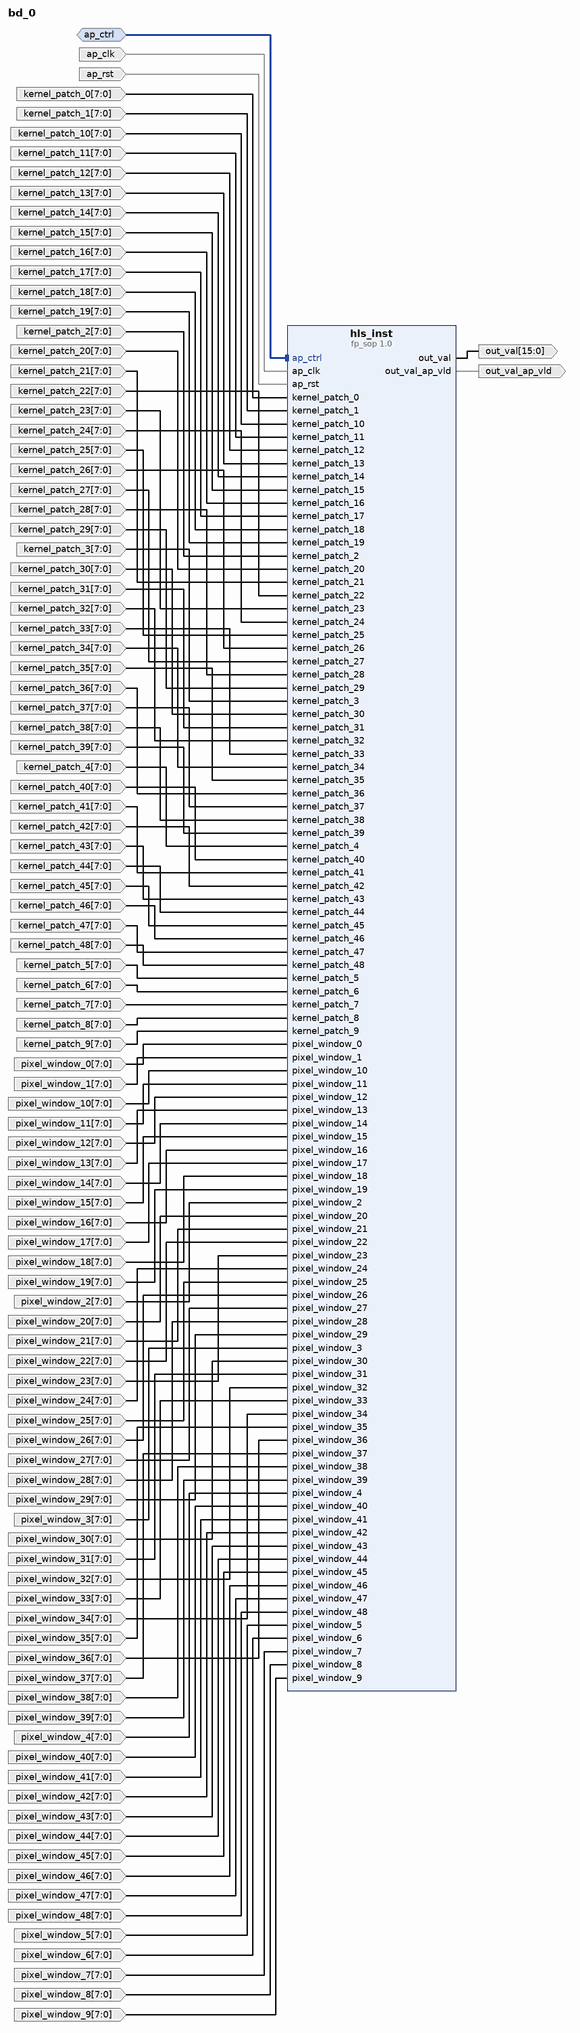
[diagram p0: block diagram of the top level]
# Vivado block design bd_0, xc7a100tcsg324-1, Vivado 2019.2
create_bd_design bd_0

create_bd_intf_port -mode Slave -vlnv xilinx.com:interface:acc_handshake_rtl:1.0 ap_ctrl
create_bd_port -dir I -type clk ap_clk
set_property -dict {CONFIG.FREQ_HZ 100000000.0} [get_bd_ports ap_clk]
create_bd_port -dir I -type rst ap_rst
set_property -dict {CONFIG.POLARITY ACTIVE_HIGH} [get_bd_ports ap_rst]
create_bd_port -dir I -from 7 -to 0 -type data kernel_patch_0
create_bd_port -dir I -from 7 -to 0 -type data kernel_patch_1
create_bd_port -dir I -from 7 -to 0 -type data kernel_patch_10
create_bd_port -dir I -from 7 -to 0 -type data kernel_patch_11
create_bd_port -dir I -from 7 -to 0 -type data kernel_patch_12
create_bd_port -dir I -from 7 -to 0 -type data kernel_patch_13
create_bd_port -dir I -from 7 -to 0 -type data kernel_patch_14
create_bd_port -dir I -from 7 -to 0 -type data kernel_patch_15
create_bd_port -dir I -from 7 -to 0 -type data kernel_patch_16
create_bd_port -dir I -from 7 -to 0 -type data kernel_patch_17
create_bd_port -dir I -from 7 -to 0 -type data kernel_patch_18
create_bd_port -dir I -from 7 -to 0 -type data kernel_patch_19
create_bd_port -dir I -from 7 -to 0 -type data kernel_patch_2
create_bd_port -dir I -from 7 -to 0 -type data kernel_patch_20
create_bd_port -dir I -from 7 -to 0 -type data kernel_patch_21
create_bd_port -dir I -from 7 -to 0 -type data kernel_patch_22
create_bd_port -dir I -from 7 -to 0 -type data kernel_patch_23
create_bd_port -dir I -from 7 -to 0 -type data kernel_patch_24
create_bd_port -dir I -from 7 -to 0 -type data kernel_patch_25
create_bd_port -dir I -from 7 -to 0 -type data kernel_patch_26
create_bd_port -dir I -from 7 -to 0 -type data kernel_patch_27
create_bd_port -dir I -from 7 -to 0 -type data kernel_patch_28
create_bd_port -dir I -from 7 -to 0 -type data kernel_patch_29
create_bd_port -dir I -from 7 -to 0 -type data kernel_patch_3
create_bd_port -dir I -from 7 -to 0 -type data kernel_patch_30
create_bd_port -dir I -from 7 -to 0 -type data kernel_patch_31
create_bd_port -dir I -from 7 -to 0 -type data kernel_patch_32
create_bd_port -dir I -from 7 -to 0 -type data kernel_patch_33
create_bd_port -dir I -from 7 -to 0 -type data kernel_patch_34
create_bd_port -dir I -from 7 -to 0 -type data kernel_patch_35
create_bd_port -dir I -from 7 -to 0 -type data kernel_patch_36
create_bd_port -dir I -from 7 -to 0 -type data kernel_patch_37
create_bd_port -dir I -from 7 -to 0 -type data kernel_patch_38
create_bd_port -dir I -from 7 -to 0 -type data kernel_patch_39
create_bd_port -dir I -from 7 -to 0 -type data kernel_patch_4
create_bd_port -dir I -from 7 -to 0 -type data kernel_patch_40
create_bd_port -dir I -from 7 -to 0 -type data kernel_patch_41
create_bd_port -dir I -from 7 -to 0 -type data kernel_patch_42
create_bd_port -dir I -from 7 -to 0 -type data kernel_patch_43
create_bd_port -dir I -from 7 -to 0 -type data kernel_patch_44
create_bd_port -dir I -from 7 -to 0 -type data kernel_patch_45
create_bd_port -dir I -from 7 -to 0 -type data kernel_patch_46
create_bd_port -dir I -from 7 -to 0 -type data kernel_patch_47
create_bd_port -dir I -from 7 -to 0 -type data kernel_patch_48
create_bd_port -dir I -from 7 -to 0 -type data kernel_patch_5
create_bd_port -dir I -from 7 -to 0 -type data kernel_patch_6
create_bd_port -dir I -from 7 -to 0 -type data kernel_patch_7
create_bd_port -dir I -from 7 -to 0 -type data kernel_patch_8
create_bd_port -dir I -from 7 -to 0 -type data kernel_patch_9
create_bd_port -dir O -from 15 -to 0 -type data out_val
create_bd_port -dir O out_val_ap_vld
create_bd_port -dir I -from 7 -to 0 -type data pixel_window_0
create_bd_port -dir I -from 7 -to 0 -type data pixel_window_1
create_bd_port -dir I -from 7 -to 0 -type data pixel_window_10
create_bd_port -dir I -from 7 -to 0 -type data pixel_window_11
create_bd_port -dir I -from 7 -to 0 -type data pixel_window_12
create_bd_port -dir I -from 7 -to 0 -type data pixel_window_13
create_bd_port -dir I -from 7 -to 0 -type data pixel_window_14
create_bd_port -dir I -from 7 -to 0 -type data pixel_window_15
create_bd_port -dir I -from 7 -to 0 -type data pixel_window_16
create_bd_port -dir I -from 7 -to 0 -type data pixel_window_17
create_bd_port -dir I -from 7 -to 0 -type data pixel_window_18
create_bd_port -dir I -from 7 -to 0 -type data pixel_window_19
create_bd_port -dir I -from 7 -to 0 -type data pixel_window_2
create_bd_port -dir I -from 7 -to 0 -type data pixel_window_20
create_bd_port -dir I -from 7 -to 0 -type data pixel_window_21
create_bd_port -dir I -from 7 -to 0 -type data pixel_window_22
create_bd_port -dir I -from 7 -to 0 -type data pixel_window_23
create_bd_port -dir I -from 7 -to 0 -type data pixel_window_24
create_bd_port -dir I -from 7 -to 0 -type data pixel_window_25
create_bd_port -dir I -from 7 -to 0 -type data pixel_window_26
create_bd_port -dir I -from 7 -to 0 -type data pixel_window_27
create_bd_port -dir I -from 7 -to 0 -type data pixel_window_28
create_bd_port -dir I -from 7 -to 0 -type data pixel_window_29
create_bd_port -dir I -from 7 -to 0 -type data pixel_window_3
create_bd_port -dir I -from 7 -to 0 -type data pixel_window_30
create_bd_port -dir I -from 7 -to 0 -type data pixel_window_31
create_bd_port -dir I -from 7 -to 0 -type data pixel_window_32
create_bd_port -dir I -from 7 -to 0 -type data pixel_window_33
create_bd_port -dir I -from 7 -to 0 -type data pixel_window_34
create_bd_port -dir I -from 7 -to 0 -type data pixel_window_35
create_bd_port -dir I -from 7 -to 0 -type data pixel_window_36
create_bd_port -dir I -from 7 -to 0 -type data pixel_window_37
create_bd_port -dir I -from 7 -to 0 -type data pixel_window_38
create_bd_port -dir I -from 7 -to 0 -type data pixel_window_39
create_bd_port -dir I -from 7 -to 0 -type data pixel_window_4
create_bd_port -dir I -from 7 -to 0 -type data pixel_window_40
create_bd_port -dir I -from 7 -to 0 -type data pixel_window_41
create_bd_port -dir I -from 7 -to 0 -type data pixel_window_42
create_bd_port -dir I -from 7 -to 0 -type data pixel_window_43
create_bd_port -dir I -from 7 -to 0 -type data pixel_window_44
create_bd_port -dir I -from 7 -to 0 -type data pixel_window_45
create_bd_port -dir I -from 7 -to 0 -type data pixel_window_46
create_bd_port -dir I -from 7 -to 0 -type data pixel_window_47
create_bd_port -dir I -from 7 -to 0 -type data pixel_window_48
create_bd_port -dir I -from 7 -to 0 -type data pixel_window_5
create_bd_port -dir I -from 7 -to 0 -type data pixel_window_6
create_bd_port -dir I -from 7 -to 0 -type data pixel_window_7
create_bd_port -dir I -from 7 -to 0 -type data pixel_window_8
create_bd_port -dir I -from 7 -to 0 -type data pixel_window_9

create_bd_cell -type ip -vlnv xilinx.com:hls:fp_sop:1.0 hls_inst

# ---- connections ----

connect_bd_intf_net -intf_net ap_ctrl_0_1 [get_bd_intf_ports ap_ctrl] [get_bd_intf_pins hls_inst/ap_ctrl]
connect_bd_net -net ap_clk_0_1 [get_bd_ports ap_clk] [get_bd_pins hls_inst/ap_clk]
connect_bd_net -net ap_rst_0_1 [get_bd_ports ap_rst] [get_bd_pins hls_inst/ap_rst]
connect_bd_net -net kernel_patch_0_0_1 [get_bd_ports kernel_patch_0] [get_bd_pins hls_inst/kernel_patch_0]
connect_bd_net -net kernel_patch_1_0_1 [get_bd_ports kernel_patch_1] [get_bd_pins hls_inst/kernel_patch_1]
connect_bd_net -net kernel_patch_10_0_1 [get_bd_ports kernel_patch_10] [get_bd_pins hls_inst/kernel_patch_10]
connect_bd_net -net kernel_patch_11_0_1 [get_bd_ports kernel_patch_11] [get_bd_pins hls_inst/kernel_patch_11]
connect_bd_net -net kernel_patch_12_0_1 [get_bd_ports kernel_patch_12] [get_bd_pins hls_inst/kernel_patch_12]
connect_bd_net -net kernel_patch_13_0_1 [get_bd_ports kernel_patch_13] [get_bd_pins hls_inst/kernel_patch_13]
connect_bd_net -net kernel_patch_14_0_1 [get_bd_ports kernel_patch_14] [get_bd_pins hls_inst/kernel_patch_14]
connect_bd_net -net kernel_patch_15_0_1 [get_bd_ports kernel_patch_15] [get_bd_pins hls_inst/kernel_patch_15]
connect_bd_net -net kernel_patch_16_0_1 [get_bd_ports kernel_patch_16] [get_bd_pins hls_inst/kernel_patch_16]
connect_bd_net -net kernel_patch_17_0_1 [get_bd_ports kernel_patch_17] [get_bd_pins hls_inst/kernel_patch_17]
connect_bd_net -net kernel_patch_18_0_1 [get_bd_ports kernel_patch_18] [get_bd_pins hls_inst/kernel_patch_18]
connect_bd_net -net kernel_patch_19_0_1 [get_bd_ports kernel_patch_19] [get_bd_pins hls_inst/kernel_patch_19]
connect_bd_net -net kernel_patch_2_0_1 [get_bd_ports kernel_patch_2] [get_bd_pins hls_inst/kernel_patch_2]
connect_bd_net -net kernel_patch_20_0_1 [get_bd_ports kernel_patch_20] [get_bd_pins hls_inst/kernel_patch_20]
connect_bd_net -net kernel_patch_21_0_1 [get_bd_ports kernel_patch_21] [get_bd_pins hls_inst/kernel_patch_21]
connect_bd_net -net kernel_patch_22_0_1 [get_bd_ports kernel_patch_22] [get_bd_pins hls_inst/kernel_patch_22]
connect_bd_net -net kernel_patch_23_0_1 [get_bd_ports kernel_patch_23] [get_bd_pins hls_inst/kernel_patch_23]
connect_bd_net -net kernel_patch_24_0_1 [get_bd_ports kernel_patch_24] [get_bd_pins hls_inst/kernel_patch_24]
connect_bd_net -net kernel_patch_25_0_1 [get_bd_ports kernel_patch_25] [get_bd_pins hls_inst/kernel_patch_25]
connect_bd_net -net kernel_patch_26_0_1 [get_bd_ports kernel_patch_26] [get_bd_pins hls_inst/kernel_patch_26]
connect_bd_net -net kernel_patch_27_0_1 [get_bd_ports kernel_patch_27] [get_bd_pins hls_inst/kernel_patch_27]
connect_bd_net -net kernel_patch_28_0_1 [get_bd_ports kernel_patch_28] [get_bd_pins hls_inst/kernel_patch_28]
connect_bd_net -net kernel_patch_29_0_1 [get_bd_ports kernel_patch_29] [get_bd_pins hls_inst/kernel_patch_29]
connect_bd_net -net kernel_patch_3_0_1 [get_bd_ports kernel_patch_3] [get_bd_pins hls_inst/kernel_patch_3]
connect_bd_net -net kernel_patch_30_0_1 [get_bd_ports kernel_patch_30] [get_bd_pins hls_inst/kernel_patch_30]
connect_bd_net -net kernel_patch_31_0_1 [get_bd_ports kernel_patch_31] [get_bd_pins hls_inst/kernel_patch_31]
connect_bd_net -net kernel_patch_32_0_1 [get_bd_ports kernel_patch_32] [get_bd_pins hls_inst/kernel_patch_32]
connect_bd_net -net kernel_patch_33_0_1 [get_bd_ports kernel_patch_33] [get_bd_pins hls_inst/kernel_patch_33]
connect_bd_net -net kernel_patch_34_0_1 [get_bd_ports kernel_patch_34] [get_bd_pins hls_inst/kernel_patch_34]
connect_bd_net -net kernel_patch_35_0_1 [get_bd_ports kernel_patch_35] [get_bd_pins hls_inst/kernel_patch_35]
connect_bd_net -net kernel_patch_36_0_1 [get_bd_ports kernel_patch_36] [get_bd_pins hls_inst/kernel_patch_36]
connect_bd_net -net kernel_patch_37_0_1 [get_bd_ports kernel_patch_37] [get_bd_pins hls_inst/kernel_patch_37]
connect_bd_net -net kernel_patch_38_0_1 [get_bd_ports kernel_patch_38] [get_bd_pins hls_inst/kernel_patch_38]
connect_bd_net -net kernel_patch_39_0_1 [get_bd_ports kernel_patch_39] [get_bd_pins hls_inst/kernel_patch_39]
connect_bd_net -net kernel_patch_4_0_1 [get_bd_ports kernel_patch_4] [get_bd_pins hls_inst/kernel_patch_4]
connect_bd_net -net kernel_patch_40_0_1 [get_bd_ports kernel_patch_40] [get_bd_pins hls_inst/kernel_patch_40]
connect_bd_net -net kernel_patch_41_0_1 [get_bd_ports kernel_patch_41] [get_bd_pins hls_inst/kernel_patch_41]
connect_bd_net -net kernel_patch_42_0_1 [get_bd_ports kernel_patch_42] [get_bd_pins hls_inst/kernel_patch_42]
connect_bd_net -net kernel_patch_43_0_1 [get_bd_ports kernel_patch_43] [get_bd_pins hls_inst/kernel_patch_43]
connect_bd_net -net kernel_patch_44_0_1 [get_bd_ports kernel_patch_44] [get_bd_pins hls_inst/kernel_patch_44]
connect_bd_net -net kernel_patch_45_0_1 [get_bd_ports kernel_patch_45] [get_bd_pins hls_inst/kernel_patch_45]
connect_bd_net -net kernel_patch_46_0_1 [get_bd_ports kernel_patch_46] [get_bd_pins hls_inst/kernel_patch_46]
connect_bd_net -net kernel_patch_47_0_1 [get_bd_ports kernel_patch_47] [get_bd_pins hls_inst/kernel_patch_47]
connect_bd_net -net kernel_patch_48_0_1 [get_bd_ports kernel_patch_48] [get_bd_pins hls_inst/kernel_patch_48]
connect_bd_net -net kernel_patch_5_0_1 [get_bd_ports kernel_patch_5] [get_bd_pins hls_inst/kernel_patch_5]
connect_bd_net -net kernel_patch_6_0_1 [get_bd_ports kernel_patch_6] [get_bd_pins hls_inst/kernel_patch_6]
connect_bd_net -net kernel_patch_7_0_1 [get_bd_ports kernel_patch_7] [get_bd_pins hls_inst/kernel_patch_7]
connect_bd_net -net kernel_patch_8_0_1 [get_bd_ports kernel_patch_8] [get_bd_pins hls_inst/kernel_patch_8]
connect_bd_net -net kernel_patch_9_0_1 [get_bd_ports kernel_patch_9] [get_bd_pins hls_inst/kernel_patch_9]
connect_bd_net [get_bd_pins hls_inst/out_val] [get_bd_ports out_val]
connect_bd_net [get_bd_pins hls_inst/out_val_ap_vld] [get_bd_ports out_val_ap_vld]
connect_bd_net -net pixel_window_0_0_1 [get_bd_ports pixel_window_0] [get_bd_pins hls_inst/pixel_window_0]
connect_bd_net -net pixel_window_1_0_1 [get_bd_ports pixel_window_1] [get_bd_pins hls_inst/pixel_window_1]
connect_bd_net -net pixel_window_10_0_1 [get_bd_ports pixel_window_10] [get_bd_pins hls_inst/pixel_window_10]
connect_bd_net -net pixel_window_11_0_1 [get_bd_ports pixel_window_11] [get_bd_pins hls_inst/pixel_window_11]
connect_bd_net -net pixel_window_12_0_1 [get_bd_ports pixel_window_12] [get_bd_pins hls_inst/pixel_window_12]
connect_bd_net -net pixel_window_13_0_1 [get_bd_ports pixel_window_13] [get_bd_pins hls_inst/pixel_window_13]
connect_bd_net -net pixel_window_14_0_1 [get_bd_ports pixel_window_14] [get_bd_pins hls_inst/pixel_window_14]
connect_bd_net -net pixel_window_15_0_1 [get_bd_ports pixel_window_15] [get_bd_pins hls_inst/pixel_window_15]
connect_bd_net -net pixel_window_16_0_1 [get_bd_ports pixel_window_16] [get_bd_pins hls_inst/pixel_window_16]
connect_bd_net -net pixel_window_17_0_1 [get_bd_ports pixel_window_17] [get_bd_pins hls_inst/pixel_window_17]
connect_bd_net -net pixel_window_18_0_1 [get_bd_ports pixel_window_18] [get_bd_pins hls_inst/pixel_window_18]
connect_bd_net -net pixel_window_19_0_1 [get_bd_ports pixel_window_19] [get_bd_pins hls_inst/pixel_window_19]
connect_bd_net -net pixel_window_2_0_1 [get_bd_ports pixel_window_2] [get_bd_pins hls_inst/pixel_window_2]
connect_bd_net -net pixel_window_20_0_1 [get_bd_ports pixel_window_20] [get_bd_pins hls_inst/pixel_window_20]
connect_bd_net -net pixel_window_21_0_1 [get_bd_ports pixel_window_21] [get_bd_pins hls_inst/pixel_window_21]
connect_bd_net -net pixel_window_22_0_1 [get_bd_ports pixel_window_22] [get_bd_pins hls_inst/pixel_window_22]
connect_bd_net -net pixel_window_23_0_1 [get_bd_ports pixel_window_23] [get_bd_pins hls_inst/pixel_window_23]
connect_bd_net -net pixel_window_24_0_1 [get_bd_ports pixel_window_24] [get_bd_pins hls_inst/pixel_window_24]
connect_bd_net -net pixel_window_25_0_1 [get_bd_ports pixel_window_25] [get_bd_pins hls_inst/pixel_window_25]
connect_bd_net -net pixel_window_26_0_1 [get_bd_ports pixel_window_26] [get_bd_pins hls_inst/pixel_window_26]
connect_bd_net -net pixel_window_27_0_1 [get_bd_ports pixel_window_27] [get_bd_pins hls_inst/pixel_window_27]
connect_bd_net -net pixel_window_28_0_1 [get_bd_ports pixel_window_28] [get_bd_pins hls_inst/pixel_window_28]
connect_bd_net -net pixel_window_29_0_1 [get_bd_ports pixel_window_29] [get_bd_pins hls_inst/pixel_window_29]
connect_bd_net -net pixel_window_3_0_1 [get_bd_ports pixel_window_3] [get_bd_pins hls_inst/pixel_window_3]
connect_bd_net -net pixel_window_30_0_1 [get_bd_ports pixel_window_30] [get_bd_pins hls_inst/pixel_window_30]
connect_bd_net -net pixel_window_31_0_1 [get_bd_ports pixel_window_31] [get_bd_pins hls_inst/pixel_window_31]
connect_bd_net -net pixel_window_32_0_1 [get_bd_ports pixel_window_32] [get_bd_pins hls_inst/pixel_window_32]
connect_bd_net -net pixel_window_33_0_1 [get_bd_ports pixel_window_33] [get_bd_pins hls_inst/pixel_window_33]
connect_bd_net -net pixel_window_34_0_1 [get_bd_ports pixel_window_34] [get_bd_pins hls_inst/pixel_window_34]
connect_bd_net -net pixel_window_35_0_1 [get_bd_ports pixel_window_35] [get_bd_pins hls_inst/pixel_window_35]
connect_bd_net -net pixel_window_36_0_1 [get_bd_ports pixel_window_36] [get_bd_pins hls_inst/pixel_window_36]
connect_bd_net -net pixel_window_37_0_1 [get_bd_ports pixel_window_37] [get_bd_pins hls_inst/pixel_window_37]
connect_bd_net -net pixel_window_38_0_1 [get_bd_ports pixel_window_38] [get_bd_pins hls_inst/pixel_window_38]
connect_bd_net -net pixel_window_39_0_1 [get_bd_ports pixel_window_39] [get_bd_pins hls_inst/pixel_window_39]
connect_bd_net -net pixel_window_4_0_1 [get_bd_ports pixel_window_4] [get_bd_pins hls_inst/pixel_window_4]
connect_bd_net -net pixel_window_40_0_1 [get_bd_ports pixel_window_40] [get_bd_pins hls_inst/pixel_window_40]
connect_bd_net -net pixel_window_41_0_1 [get_bd_ports pixel_window_41] [get_bd_pins hls_inst/pixel_window_41]
connect_bd_net -net pixel_window_42_0_1 [get_bd_ports pixel_window_42] [get_bd_pins hls_inst/pixel_window_42]
connect_bd_net -net pixel_window_43_0_1 [get_bd_ports pixel_window_43] [get_bd_pins hls_inst/pixel_window_43]
connect_bd_net -net pixel_window_44_0_1 [get_bd_ports pixel_window_44] [get_bd_pins hls_inst/pixel_window_44]
connect_bd_net -net pixel_window_45_0_1 [get_bd_ports pixel_window_45] [get_bd_pins hls_inst/pixel_window_45]
connect_bd_net -net pixel_window_46_0_1 [get_bd_ports pixel_window_46] [get_bd_pins hls_inst/pixel_window_46]
connect_bd_net -net pixel_window_47_0_1 [get_bd_ports pixel_window_47] [get_bd_pins hls_inst/pixel_window_47]
connect_bd_net -net pixel_window_48_0_1 [get_bd_ports pixel_window_48] [get_bd_pins hls_inst/pixel_window_48]
connect_bd_net -net pixel_window_5_0_1 [get_bd_ports pixel_window_5] [get_bd_pins hls_inst/pixel_window_5]
connect_bd_net -net pixel_window_6_0_1 [get_bd_ports pixel_window_6] [get_bd_pins hls_inst/pixel_window_6]
connect_bd_net -net pixel_window_7_0_1 [get_bd_ports pixel_window_7] [get_bd_pins hls_inst/pixel_window_7]
connect_bd_net -net pixel_window_8_0_1 [get_bd_ports pixel_window_8] [get_bd_pins hls_inst/pixel_window_8]
connect_bd_net -net pixel_window_9_0_1 [get_bd_ports pixel_window_9] [get_bd_pins hls_inst/pixel_window_9]

validate_bd_design
save_bd_design
